# Altium schematic sheet 03 DDR3.SchDoc
size 420 x 297 mm
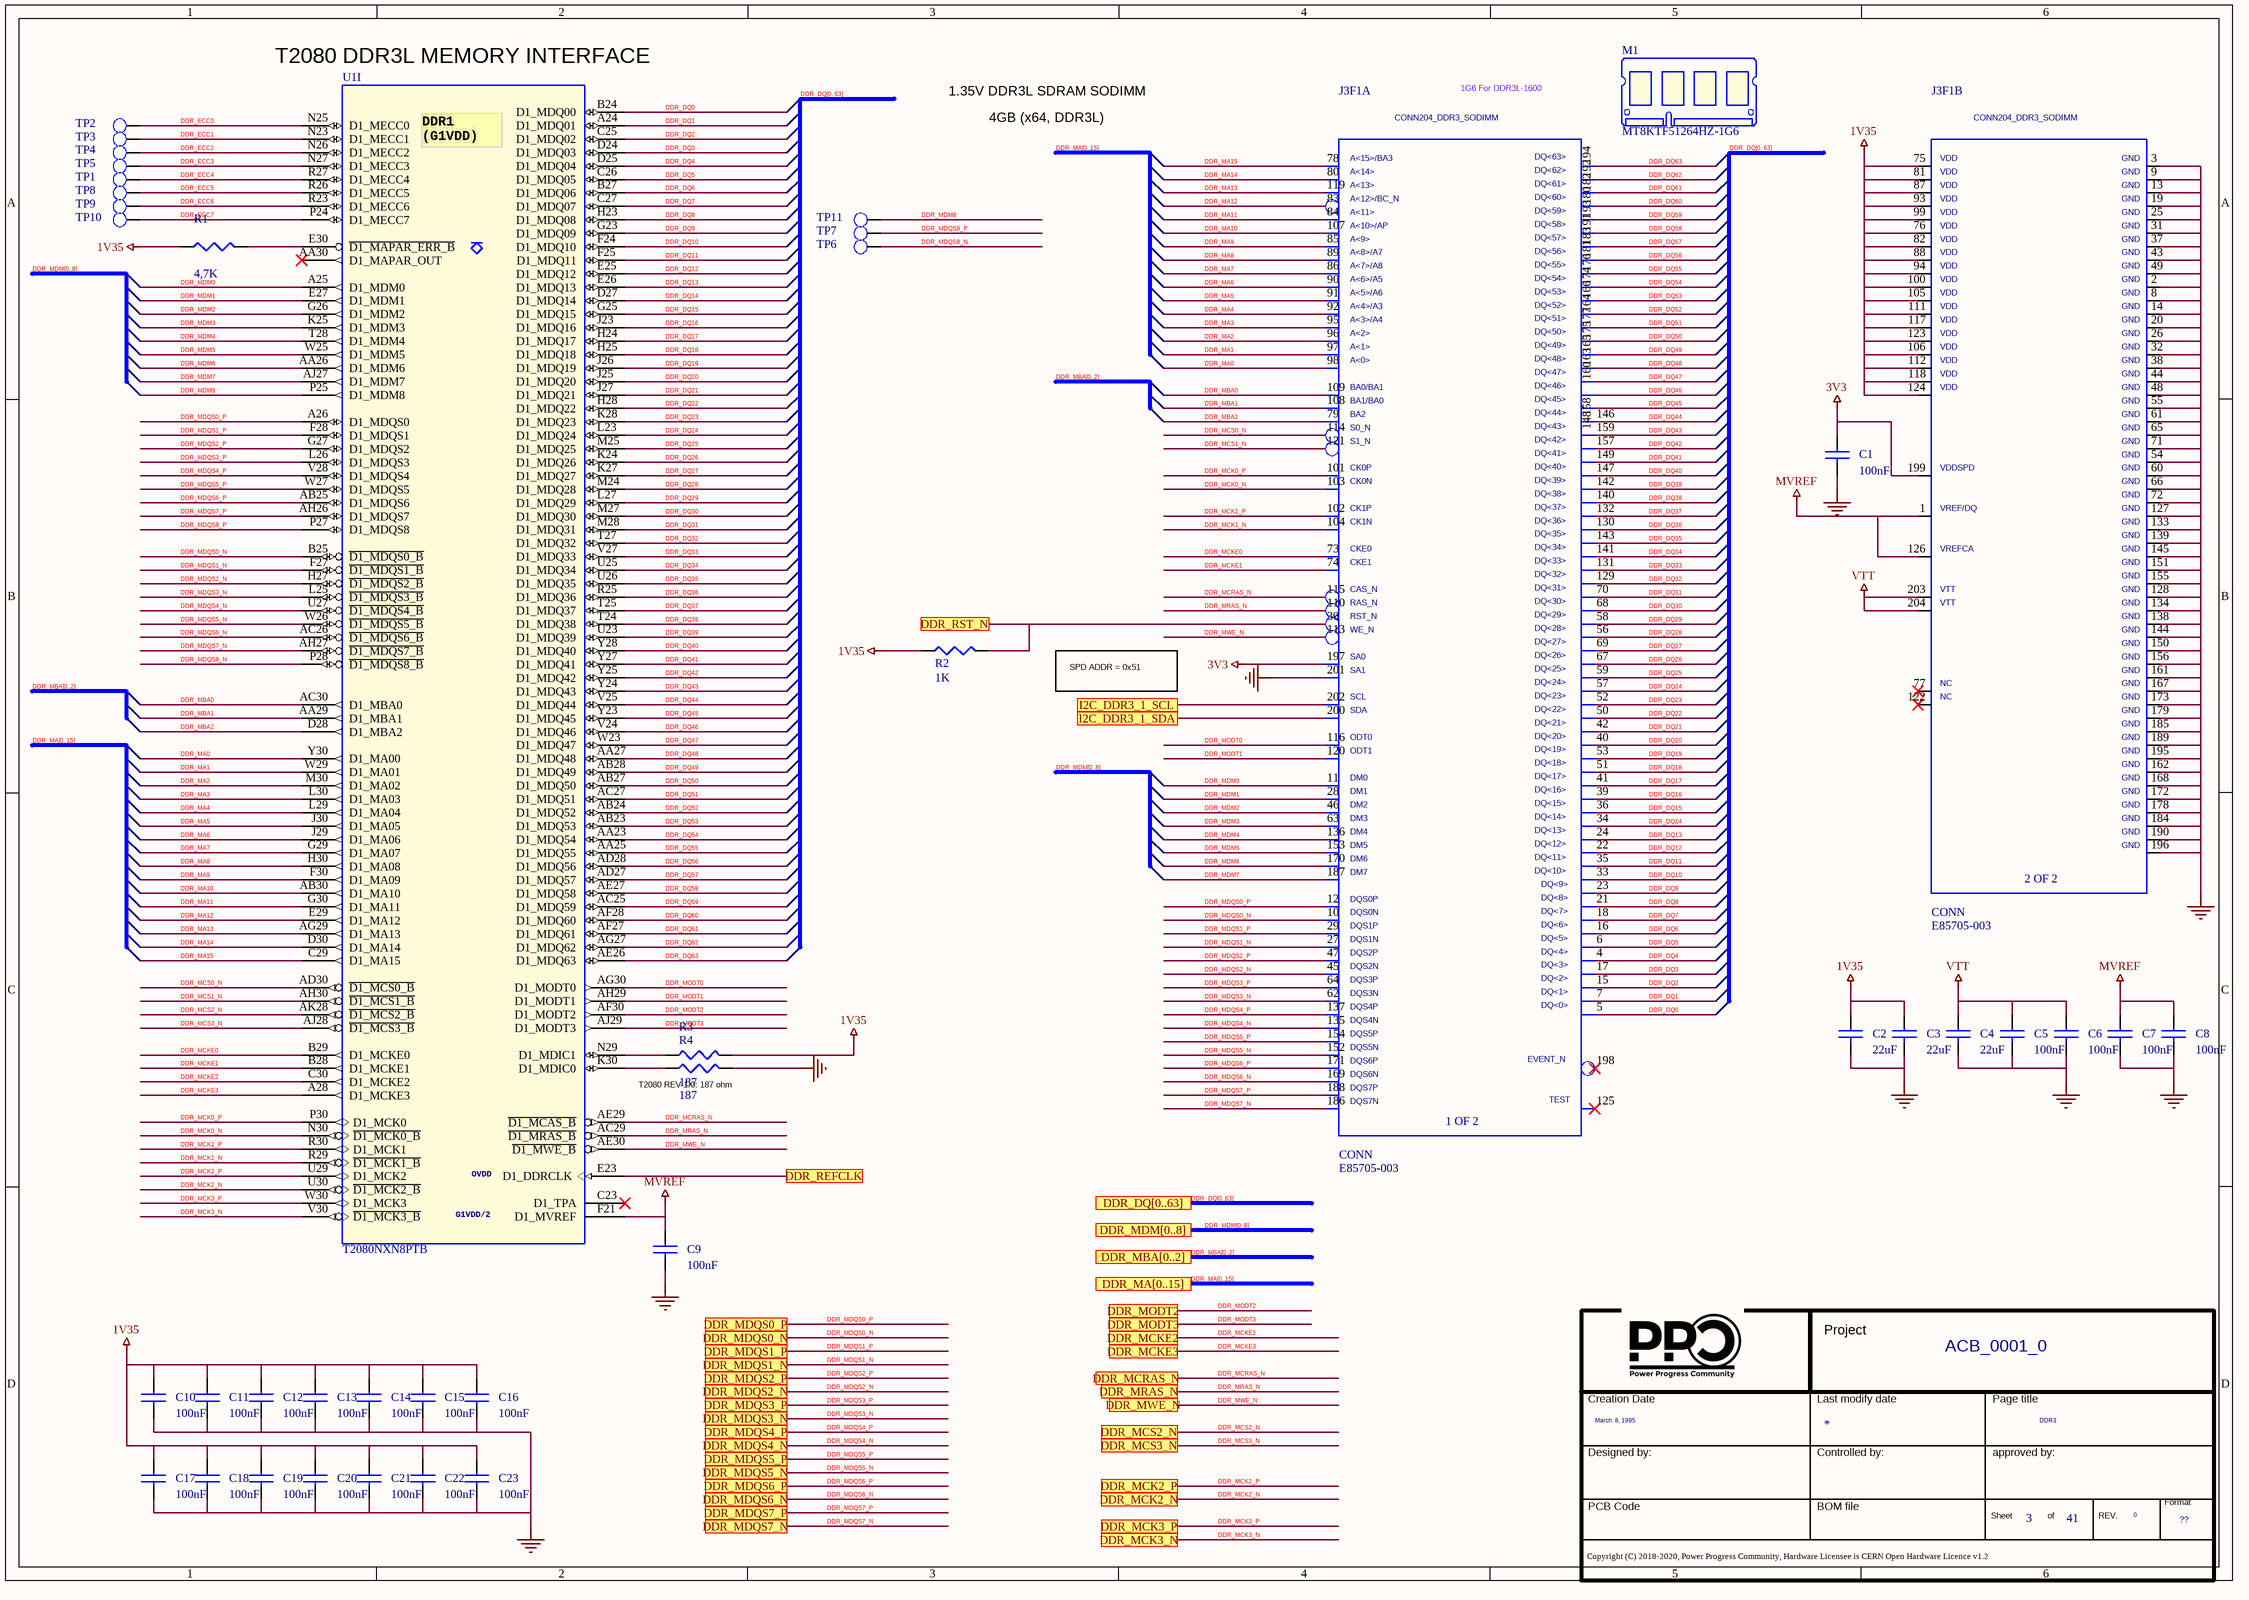
[diagram p0: 03 DDR3.SchDoc]

## Parts
*  Page Count: 41  Page Create Date: March  8, 1995  Page Number: 3  Page Size: ??  Page Title: DDR3  RevCode: 0  Title: ACB_0001_0  (hidden comment: Title_block_PPC)  (graphical)
C1  100nF  [SMD_0402]
C2  22uF  [SMD_0805]
C3  22uF  [SMD_0805]
C4  22uF  [SMD_0805]
C5  100nF  [SMD_0402]
C6  100nF  [SMD_0402]
C7  100nF  [SMD_0402]
C8  100nF  [SMD_0402]
C9  100nF  [SMD_0402]
C10  100nF  [SMD_0402]
C11  100nF  [SMD_0402]
C12  100nF  [SMD_0402]
C13  100nF  [SMD_0402]
C14  100nF  [SMD_0402]
C15  100nF  [SMD_0402]
C16  100nF  [SMD_0402]
C17  100nF  [SMD_0402]
C18  100nF  [SMD_0402]
C19  100nF  [SMD_0402]
C20  100nF  [SMD_0402]
C21  100nF  [SMD_0402]
C22  100nF  [SMD_0402]
C23  100nF  [SMD_0402]
J3F1  MATERIAL: CONN  PART_NUMBER: E85705-003  PART_SYM_NUM: 1 OF 2  [204 PIN PASSO 0.6mm]  (hidden comment: 2013022-1)  (parts A,B of 2)
M1  MT8KTF51264HZ-1G6  [none]
R1  4,7K  [SMD_0402]
R2  1K  [SMD_0402]
R3  187  [SMD_0402]
R4  187  [SMD_0402]
TP1  TEST POINT  [PCB]  (value not drawn)
TP2  TEST POINT  [PCB]  (value not drawn)
TP3  TEST POINT  [PCB]  (value not drawn)
TP4  TEST POINT  [PCB]  (value not drawn)
TP5  TEST POINT  [PCB]  (value not drawn)
TP6  TEST POINT  [PCB]  (value not drawn)
TP7  TEST POINT  [PCB]  (value not drawn)
TP8  TEST POINT  [PCB]  (value not drawn)
TP9  TEST POINT  [PCB]  (value not drawn)
TP10  TEST POINT  [PCB]  (value not drawn)
TP11  TEST POINT  [PCB]  (value not drawn)
U1  T2080NXN8PTB  [bga]  (part I of 14)

## Ports
DDR_DQ[0..63], DDR_MA[0..15], DDR_MBA[0..2], DDR_MCK2_N, DDR_MCK2_P, DDR_MCK3_N, DDR_MCK3_P, DDR_MCKE2, DDR_MCKE3, DDR_MCRAS_N, DDR_MCS2_N, DDR_MCS3_N, DDR_MDM[0..8], DDR_MDQS0_N, DDR_MDQS0_P, DDR_MDQS1_N, DDR_MDQS1_P, DDR_MDQS2_N, DDR_MDQS2_P, DDR_MDQS3_N, DDR_MDQS3_P, DDR_MDQS4_N, DDR_MDQS4_P, DDR_MDQS5_N, DDR_MDQS5_P, DDR_MDQS6_N, DDR_MDQS6_P, DDR_MDQS7_N, DDR_MDQS7_P, DDR_MODT2, DDR_MODT3, DDR_MRAS_N, DDR_MWE_N, DDR_REFCLK, DDR_RST_N, I2C_DDR3_1_SCL, I2C_DDR3_1_SDA

## Nets
1V35: C2.1 C3.1 C10.1 C11.1 C12.1 C13.1 C14.1 C15.1 C16.1 C17.1 C18.1 C19.1 C20.1 C21.1 C22.1 C23.1 J3F1.75(VDD_75) J3F1.76(VDD_76) J3F1.81(VDD_81) J3F1.82(VDD_82) J3F1.87(VDD_87) J3F1.88(VDD_88) J3F1.93(VDD_93) J3F1.94(VDD_94) J3F1.99(VDD_99) J3F1.100(VDD_100) J3F1.105(VDD_105) J3F1.106(VDD_106) J3F1.111(VDD_111) J3F1.112(VDD_112) J3F1.117(VDD_117) J3F1.118(VDD_118) J3F1.123(VDD_123) J3F1.124(VDD_124) R1.1 R2.1 R3.2
3V3: C1.1 J3F1.197(SA0) J3F1.199(VDDSPD)
GND: C1.2 C2.2 C3.2 C4.2 C5.2 C6.2 C7.2 C8.2 C9.2 C10.2 C11.2 C12.2 C13.2 C14.2 C15.2 C16.2 C17.2 C18.2 C19.2 C20.2 C21.2 C22.2 C23.2 J3F1.2(GND_2) J3F1.3(GND_3) J3F1.8(GND_8) J3F1.9(GND_9) J3F1.13(GND_13) J3F1.14(GND_14) J3F1.19(GND_19) J3F1.20(GND_20) J3F1.25(GND_25) J3F1.26(GND_26) J3F1.31(GND_31) J3F1.32(GND_32) J3F1.37(GND_37) J3F1.38(GND_38) J3F1.43(GND_43) J3F1.44(GND_44) J3F1.48(GND_48) J3F1.49(GND_49) J3F1.54(GND_54) J3F1.55(GND_55) J3F1.60(GND_60) J3F1.61(GND_61) J3F1.65(GND_65) J3F1.66(GND_66) J3F1.71(GND_71) J3F1.72(GND_72) J3F1.127(GND_127) J3F1.128(GND_128) J3F1.133(GND_133) J3F1.134(GND_134) J3F1.138(GND_138) J3F1.139(GND_139) J3F1.144(GND_144) J3F1.145(GND_145) J3F1.150(GND_150) J3F1.151(GND_151) J3F1.155(GND_155) J3F1.156(GND_156) J3F1.161(GND_161) J3F1.162(GND_162) J3F1.167(GND_167) J3F1.168(GND_168) J3F1.172(GND_172) J3F1.173(GND_173) J3F1.178(GND_178) J3F1.179(GND_179) J3F1.184(GND_184) J3F1.185(GND_185) J3F1.189(GND_189) J3F1.190(GND_190) J3F1.195(GND_195) J3F1.196(GND_196) J3F1.201(SA1) R4.2
MVREF: C7.1 C8.1 C9.1 J3F1.1(VREF_DQ) J3F1.126(VREFCA) U1.F21(D1_MVREF)
VTT: C4.1 C5.1 C6.1 J3F1.203(VTT_203) J3F1.204(VTT_204)
DDR_DQ0: J3F1.5(DQ[0]) U1.B24(D1_MDQ00)
DDR_DQ1: J3F1.7(DQ[1]) U1.A24(D1_MDQ01)
DDR_DQ2: J3F1.15(DQ[2]) U1.C25(D1_MDQ02)
DDR_DQ3: J3F1.17(DQ[3]) U1.D24(D1_MDQ03)
DDR_DQ4: J3F1.4(DQ[4]) U1.D25(D1_MDQ04)
DDR_DQ5: J3F1.6(DQ[5]) U1.C26(D1_MDQ05)
DDR_DQ6: J3F1.16(DQ[6]) U1.B27(D1_MDQ06)
DDR_DQ7: J3F1.18(DQ[7]) U1.C27(D1_MDQ07)
DDR_DQ8: J3F1.21(DQ[8]) U1.H23(D1_MDQ08)
DDR_DQ9: J3F1.23(DQ[9]) U1.G23(D1_MDQ09)
DDR_DQ10: J3F1.33(DQ[10]) U1.F24(D1_MDQ10)
DDR_DQ11: J3F1.35(DQ[11]) U1.F25(D1_MDQ11)
DDR_DQ12: J3F1.22(DQ[12]) U1.E25(D1_MDQ12)
DDR_DQ13: J3F1.24(DQ[13]) U1.E26(D1_MDQ13)
DDR_DQ14: J3F1.34(DQ[14]) U1.D27(D1_MDQ14)
DDR_DQ15: J3F1.36(DQ[15]) U1.G25(D1_MDQ15)
DDR_DQ16: J3F1.39(DQ[16]) U1.J23(D1_MDQ16)
DDR_DQ17: J3F1.41(DQ[17]) U1.H24(D1_MDQ17)
DDR_DQ18: J3F1.51(DQ[18]) U1.H25(D1_MDQ18)
DDR_DQ19: J3F1.53(DQ[19]) U1.J26(D1_MDQ19)
DDR_DQ20: J3F1.40(DQ[20]) U1.J25(D1_MDQ20)
DDR_DQ21: J3F1.42(DQ[21]) U1.J27(D1_MDQ21)
DDR_DQ22: J3F1.50(DQ[22]) U1.H28(D1_MDQ22)
DDR_DQ23: J3F1.52(DQ[23]) U1.K28(D1_MDQ23)
DDR_DQ24: J3F1.57(DQ[24]) U1.L23(D1_MDQ24)
DDR_DQ25: J3F1.59(DQ[25]) U1.M25(D1_MDQ25)
DDR_DQ26: J3F1.67(DQ[26]) U1.K24(D1_MDQ26)
DDR_DQ27: J3F1.69(DQ[27]) U1.K27(D1_MDQ27)
DDR_DQ28: J3F1.56(DQ[28]) U1.M24(D1_MDQ28)
DDR_DQ29: J3F1.58(DQ[29]) U1.L27(D1_MDQ29)
DDR_DQ30: J3F1.68(DQ[30]) U1.M27(D1_MDQ30)
DDR_DQ31: J3F1.70(DQ[31]) U1.M28(D1_MDQ31)
DDR_DQ32: J3F1.129(DQ[32]) U1.T27(D1_MDQ32)
DDR_DQ33: J3F1.131(DQ[33]) U1.V27(D1_MDQ33)
DDR_DQ34: J3F1.141(DQ[34]) U1.U25(D1_MDQ34)
DDR_DQ35: J3F1.143(DQ[35]) U1.U26(D1_MDQ35)
DDR_DQ36: J3F1.130(DQ[36]) U1.R25(D1_MDQ36)
DDR_DQ37: J3F1.132(DQ[37]) U1.T25(D1_MDQ37)
DDR_DQ38: J3F1.140(DQ[38]) U1.T24(D1_MDQ38)
DDR_DQ39: J3F1.142(DQ[39]) U1.U23(D1_MDQ39)
DDR_DQ40: J3F1.147(DQ[40]) U1.Y28(D1_MDQ40)
DDR_DQ41: J3F1.149(DQ[41]) U1.Y27(D1_MDQ41)
DDR_DQ42: J3F1.157(DQ[42]) U1.Y25(D1_MDQ42)
DDR_DQ43: J3F1.159(DQ[43]) U1.Y24(D1_MDQ43)
DDR_DQ44: J3F1.146(DQ[44]) U1.V25(D1_MDQ44)
DDR_DQ45: J3F1.148(DQ[45]) U1.Y23(D1_MDQ45)
DDR_DQ46: J3F1.158(DQ[46]) U1.V24(D1_MDQ46)
DDR_DQ47: J3F1.160(DQ[47]) U1.W23(D1_MDQ47)
DDR_DQ48: J3F1.163(DQ[48]) U1.AA27(D1_MDQ48)
DDR_DQ49: J3F1.165(DQ[49]) U1.AB28(D1_MDQ49)
DDR_DQ50: J3F1.175(DQ[50]) U1.AB27(D1_MDQ50)
DDR_DQ51: J3F1.177(DQ[51]) U1.AC27(D1_MDQ51)
DDR_DQ52: J3F1.164(DQ[52]) U1.AB24(D1_MDQ52)
DDR_DQ53: J3F1.166(DQ[53]) U1.AB23(D1_MDQ53)
DDR_DQ54: J3F1.174(DQ[54]) U1.AA23(D1_MDQ54)
DDR_DQ55: J3F1.176(DQ[55]) U1.AA25(D1_MDQ55)
DDR_DQ56: J3F1.181(DQ[56]) U1.AD28(D1_MDQ56)
DDR_DQ57: J3F1.183(DQ[57]) U1.AD27(D1_MDQ57)
DDR_DQ58: J3F1.191(DQ[58]) U1.AE27(D1_MDQ58)
DDR_DQ59: J3F1.193(DQ[59]) U1.AC25(D1_MDQ59)
DDR_DQ60: J3F1.180(DQ[60]) U1.AF28(D1_MDQ60)
DDR_DQ61: J3F1.182(DQ[61]) U1.AF27(D1_MDQ61)
DDR_DQ62: J3F1.192(DQ[62]) U1.AG27(D1_MDQ62)
DDR_DQ63: J3F1.194(DQ[63]) U1.AE26(D1_MDQ63)
DDR_ECC0: TP2.1(TP) U1.N25(D1_MECC0)
DDR_ECC1: TP3.1(TP) U1.N23(D1_MECC1)
DDR_ECC2: TP4.1(TP) U1.N26(D1_MECC2)
DDR_ECC3: TP5.1(TP) U1.N27(D1_MECC3)
DDR_ECC4: TP1.1(TP) U1.R27(D1_MECC4)
DDR_ECC5: TP8.1(TP) U1.R26(D1_MECC5)
DDR_ECC6: TP9.1(TP) U1.R23(D1_MECC6)
DDR_ECC7: TP10.1(TP) U1.P24(D1_MECC7)
DDR_MA0: J3F1.98(A[0]) U1.Y30(D1_MA00)
DDR_MA1: J3F1.97(A[1]) U1.W29(D1_MA01)
DDR_MA2: J3F1.96(A[2]) U1.M30(D1_MA02)
DDR_MA3: J3F1.95(A[3]) U1.L30(D1_MA03)
DDR_MA4: J3F1.92(A[4]) U1.L29(D1_MA04)
DDR_MA5: J3F1.91(A[5]) U1.J30(D1_MA05)
DDR_MA6: J3F1.90(A[6]) U1.J29(D1_MA06)
DDR_MA7: J3F1.86(A[7]) U1.G29(D1_MA07)
DDR_MA8: J3F1.89(A[8]) U1.H30(D1_MA08)
DDR_MA9: J3F1.85(A[9]) U1.F30(D1_MA09)
DDR_MA10: J3F1.107(A[10]) U1.AB30(D1_MA10)
DDR_MA11: J3F1.84(A[11]) U1.G30(D1_MA11)
DDR_MA12: J3F1.83(A[12]) U1.E29(D1_MA12)
DDR_MA13: J3F1.119(A[13]) U1.AG29(D1_MA13)
DDR_MA14: J3F1.80(A[14]) U1.D30(D1_MA14)
DDR_MA15: J3F1.78(A[15]) U1.C29(D1_MA15)
DDR_MBA0: J3F1.109(BA0_BA1) U1.AC30(D1_MBA0)
DDR_MBA1: J3F1.108(BA1_BA0) U1.AA29(D1_MBA1)
DDR_MBA2: J3F1.79(BA2) U1.D28(D1_MBA2)
DDR_MCK0_N: J3F1.103(CK0N) U1.N30(~{D1_MCK0_B})
DDR_MCK0_P: J3F1.101(CK0P) U1.P30(D1_MCK0)
DDR_MCK1_N: J3F1.104(CK1N) U1.R29(~{D1_MCK1_B})
DDR_MCK1_P: J3F1.102(CK1P) U1.R30(D1_MCK1)
DDR_MCK2_N: U1.U30(~{D1_MCK2_B}) ; port DDR_MCK2_N
DDR_MCK2_P: U1.U29(D1_MCK2) ; port DDR_MCK2_P
DDR_MCK3_N: U1.V30(~{D1_MCK3_B}) ; port DDR_MCK3_N
DDR_MCK3_P: U1.W30(D1_MCK3) ; port DDR_MCK3_P
DDR_MCKE0: J3F1.73(CKE0) U1.B29(D1_MCKE0)
DDR_MCKE1: J3F1.74(CKE1) U1.B28(D1_MCKE1)
DDR_MCKE2: U1.C30(D1_MCKE2) ; port DDR_MCKE2
DDR_MCKE3: U1.A28(D1_MCKE3) ; port DDR_MCKE3
DDR_MCRAS_N: J3F1.115(CAS_N) U1.AE29(~{D1_MCAS_B}) ; port DDR_MCRAS_N
DDR_MCS0_N: J3F1.114(S0_N) U1.AD30(~{D1_MCS0_B})
DDR_MCS1_N: J3F1.121(S1_N) U1.AH30(~{D1_MCS1_B})
DDR_MCS2_N: U1.AK28(~{D1_MCS2_B}) ; port DDR_MCS2_N
DDR_MCS3_N: U1.AJ28(~{D1_MCS3_B}) ; port DDR_MCS3_N
DDR_MDM0: J3F1.11(DM0) U1.A25(D1_MDM0)
DDR_MDM1: J3F1.28(DM1) U1.E27(D1_MDM1)
DDR_MDM2: J3F1.46(DM2) U1.G26(D1_MDM2)
DDR_MDM3: J3F1.63(DM3) U1.K25(D1_MDM3)
DDR_MDM4: J3F1.136(DM4) U1.T28(D1_MDM4)
DDR_MDM5: J3F1.153(DM5) U1.W25(D1_MDM5)
DDR_MDM6: J3F1.170(DM6) U1.AA26(D1_MDM6)
DDR_MDM7: J3F1.187(DM7) U1.AJ27(D1_MDM7)
DDR_MDM8: TP11.1(TP) U1.P25(D1_MDM8)
DDR_MDQS0_N: J3F1.10(DQS0N) U1.B25(~{D1_MDQS0_B}) ; port DDR_MDQS0_N
DDR_MDQS0_P: J3F1.12(DQS0P) U1.A26(D1_MDQS0) ; port DDR_MDQS0_P
DDR_MDQS1_N: J3F1.27(DQS1N) U1.F27(~{D1_MDQS1_B}) ; port DDR_MDQS1_N
DDR_MDQS1_P: J3F1.29(DQS1P) U1.F28(D1_MDQS1) ; port DDR_MDQS1_P
DDR_MDQS2_N: J3F1.45(DQS2N) U1.H27(~{D1_MDQS2_B}) ; port DDR_MDQS2_N
DDR_MDQS2_P: J3F1.47(DQS2P) U1.G27(D1_MDQS2) ; port DDR_MDQS2_P
DDR_MDQS3_N: J3F1.62(DQS3N) U1.L25(~{D1_MDQS3_B}) ; port DDR_MDQS3_N
DDR_MDQS3_P: J3F1.64(DQS3P) U1.L26(D1_MDQS3) ; port DDR_MDQS3_P
DDR_MDQS4_N: J3F1.135(DQS4N) U1.U27(~{D1_MDQS4_B}) ; port DDR_MDQS4_N
DDR_MDQS4_P: J3F1.137(DQS4P) U1.V28(D1_MDQS4) ; port DDR_MDQS4_P
DDR_MDQS5_N: J3F1.152(DQS5N) U1.W26(~{D1_MDQS5_B}) ; port DDR_MDQS5_N
DDR_MDQS5_P: J3F1.154(DQS5P) U1.W27(D1_MDQS5) ; port DDR_MDQS5_P
DDR_MDQS6_N: J3F1.169(DQS6N) U1.AC26(~{D1_MDQS6_B}) ; port DDR_MDQS6_N
DDR_MDQS6_P: J3F1.171(DQS6P) U1.AB25(D1_MDQS6) ; port DDR_MDQS6_P
DDR_MDQS7_N: J3F1.186(DQS7N) U1.AH27(~{D1_MDQS7_B}) ; port DDR_MDQS7_N
DDR_MDQS7_P: J3F1.188(DQS7P) U1.AH26(D1_MDQS7) ; port DDR_MDQS7_P
DDR_MDQS8_N: TP6.1(TP) U1.P28(~{D1_MDQS8_B})
DDR_MDQS8_P: TP7.1(TP) U1.P27(D1_MDQS8)
DDR_MODT0: J3F1.116(ODT0) U1.AG30(D1_MODT0)
DDR_MODT1: J3F1.120(ODT1) U1.AH29(D1_MODT1)
DDR_MODT2: U1.AF30(D1_MODT2) ; port DDR_MODT2
DDR_MODT3: U1.AJ29(D1_MODT3) ; port DDR_MODT3
DDR_MRAS_N: J3F1.110(RAS_N) U1.AC29(~{D1_MRAS_B}) ; port DDR_MRAS_N
DDR_MWE_N: J3F1.113(WE_N) U1.AE30(~{D1_MWE_B}) ; port DDR_MWE_N
DDR_REFCLK: U1.E23(D1_DDRCLK) ; port DDR_REFCLK
DDR_RST_N: J3F1.30(RST_N) R2.2 ; port DDR_RST_N
I2C_DDR3_1_SCL: J3F1.202(SCL) ; port I2C_DDR3_1_SCL
I2C_DDR3_1_SDA: J3F1.200(SDA) ; port I2C_DDR3_1_SDA
NetR1_2: R1.2 U1.E30(~{D1_MAPAR_ERR_B})
NetR3_1: R3.1 U1.N29(D1_MDIC1)
NetR4_1: R4.1 U1.K30(D1_MDIC0)

Not connected (* = marked no-connect by the designer): J3F1 77(NC_77)* 122(NC_122)* 125(TEST)* 198(EVENT_N)*; U1 AA30(D1_MAPAR_OUT)* C23(D1_TPA)*

## Buses and harness runs
bus DDR_DQ[0..63]
bus DDR_DQ[0..63] = port DDR_DQ[0..63]
bus DDR_MA[0..15]
bus DDR_MA[0..15] = port DDR_MA[0..15]
bus DDR_MBA[0..2]
bus DDR_MBA[0..2] = port DDR_MBA[0..2]
bus DDR_MDM[0..8]
bus DDR_MDM[0..8] = port DDR_MDM[0..8]

## Notes on the sheet
- (near U1) T2080 DDR3L MEMORY INTERFACE
- 1.35V DDR3L SDRAM SODIMM
- 4GB (x64, DDR3L)
- 1G6 For DDR3L-1600
- SPD ADDR = 0x51
- (near R4) T2080 REV 1.0: 187 ohm
- (in symbol CONN204_DDR3_SODIMM, part A) A<15>/BA3; DQ<63>; A<14>; DQ<62>; A<13>; DQ<61>; A<12>/BC_N; DQ<60>; A<11>; DQ<59>; A<10>/AP; DQ<58>; A<9>; DQ<57>; A<8>/A7; DQ<56>; A<7>/A8; DQ<55>; A<6>/A5; DQ<54>; A<5>/A6; DQ<53>; A<4>/A3; DQ<52>; A<3>/A4; DQ<51>; A<2>; DQ<50>; A<1>; DQ<49>; A<0>; DQ<48>; DQ<47>; BA0/BA1; DQ<46>; BA1/BA0; DQ<45>; DQ<44>; DQ<43>; DQ<42>; DQ<41>; DQ<40>; DQ<39>; DQ<38>; DQ<37>; DQ<36>; DQ<35>; DQ<34>; DQ<33>; DQ<32>; DQ<31>; DQ<30>; DQ<29>; DQ<28>; DQ<27>; DQ<26>; DQ<25>; DQ<24>; DQ<23>; DQ<22>; DQ<21>; DQ<20>; DQ<19>; DQ<18>; DQ<17>; DQ<16>; DQ<15>; DQ<14>; DQ<13>; DQ<12>; DQ<11>; DQ<10>; DQ<9>; DQ<8>; DQ<7>; DQ<6>; DQ<5>; DQ<4>; DQ<3>; DQ<2>; DQ<1>; DQ<0>
- (in symbol CONN204_DDR3_SODIMM, part B) VDD; GND; VREF/DQ; VTT; NC
- (in symbol T2080, part I) DDR1 / (G1VDD); OVDD; G1VDD/2
- (in symbol Title_block_PPC) Project; Creation Date; Last modify date; Page title; Designed by:; Controlled by:; approved by:; Format; PCB Code; BOM file; Sheet; of; REV.; Copyright (C) 2018-2020, Power Progress Community, Hardware Licensee is CERN Open Hardware Licence v1.2

## Library data of the parts
* = Title_block_PPC: Schematic Page Count: 45; Page Modify Date: *; Schematic Page Number: 3
C1 C9 = CAP NP_Dup2: COND.CER. 100NF 50V 0402 X7R SMD; Manufacturer Part Number 1: CGA2B3X7R1H104M050BD; Manufacturer 1: TDK; Part Number: PASSIVE_24; RSM: RC0402; PCB Footprint: SMD_0402; Part Type: Capacitors\Ceramic\SMD\0402
C2-C4 = CAP NP_Dup2: 22UF 35V 20% 0805; Part Number: PASSIVE_224; Manufacturer 1: TDK; Manufacturer Part Number 1: C2012X5R1V226M125AC; RSM: RC0805; Part Type: Capacitors\Ceramic\SMD\0805; PCB Footprint: SMD_0805
C5-C8 C10-C23 = CAP NP_Dup2: COND.CER. 100NF 50V 0402 X7R SMD; Part Number: PASSIVE_24; Manufacturer 1: TDK; Manufacturer Part Number 1: CGA2B3X7R1H104M050BD; RSM: RC0402; Part Type: Capacitors\Ceramic\SMD\0402; PCB Footprint: SMD_0402
J3F1 = CONN204_DDR3_SODIMM: Connettori DIMM SEMI-HARD TRAY DDR3 204P 4H STD; Manufacturer 1: TE CONNECTIVITY; Part Number: CONNECTORS_683; CDS_PART_NAME: CONN204_DDR3_SODIMM_SMLF-E85705-003; PACK_TYPE: SMLF; OriginalSymbolOrigin: (-500,1850); RSM: TE-2013022-1; CDS_LIB: lf_for_review_only; DRAWING: @OXBOW_HILL_LIB.OXBOW_HILL(SCH_1):PAGE284; LOCATION: J3F1; PHYS_PAGE: 28; ROT: 0; VER: 1; XY: (900,1475); CaptureCellPackProp: CONN204_DDR3_SODIMMA; PCB Footprint: 204 PIN PASSO 0.6mm; Distributor 1: MOUSER(571-2013022-1); Manufacturer Part Number 1: 2013022-1; Part Type: DIMM; CDS_PHYS_PART_NAME: CONN204_DDR3_SODIMM_SMLF-E85705-003; CHIPS_PART_NAME: CONN204_DDR3_SODIMM; SEC_TYPE: SMLF
M1 = DDR_MDL: MPN: MT18KSF51272HZ-1G6; Vendor: Micron; TYPE: MEC; PCB Footprint: none
R1 = R_Dup5: RESIS.CHIP 4,7K 5% 0402 SMD; Manufacturer 1: ROYAL OHM; Part Number: PASSIVE_861; RSM: RC0402; PCB Footprint: SMD_0402; Manufacturer Part Number 1: RESIS.CHIP 4,7K 5% 0402 SMD; Part Type: Resistors\Fixed\SMD\0402\5%
R2 = R_Dup5: RESIS.CHIP 1K 1% 0402 SMD; Part Number: PASSIVE_628; Manufacturer 1: ROYAL OHM; RSM: RC0402; Part Type: Resistors\Fixed\SMD\0402\1%; Manufacturer Part Number 1: RESIS.CHIP 1K 1% 0402 SMD; PCB Footprint: SMD_0402
R3 R4 = R_Dup5: RESIS.CHIP 187R 1% 0402 SMD; Manufacturer Part Number 1: CR0402-FX-1870GLF; Manufacturer 1: bourns; Part Number: PASSIVE_1445; RSM: RC0402; Part Type: Resistors\Fixed\SMD\0402\1%; PCB Footprint: SMD_0402
TP1-TP11 = T POINT R_Dup1: TEST POINT SU PCB; Part Number: CONNECTORS_542; RSM: AE-TESTPOINT; Part Type: Tpoint; PCB Footprint: PCB
U1 = T2080: QRIQ MPU 1.87GT/s DDR3/3L 4x10GE; Manufacturer 1: NXP; Part Number: MICROPROCESSOR_65; PCB Footprint: BGA896; Vendor: Freescale; RSM: PBGA896-0_8MM-25X25; Distributor 1: MOUSER(841-T2080NXN8PTB); Manufacturer Part Number 1: T2080NXN8PTB; Part Type: 32 BIT; MPN: T2080; TYPE: IC